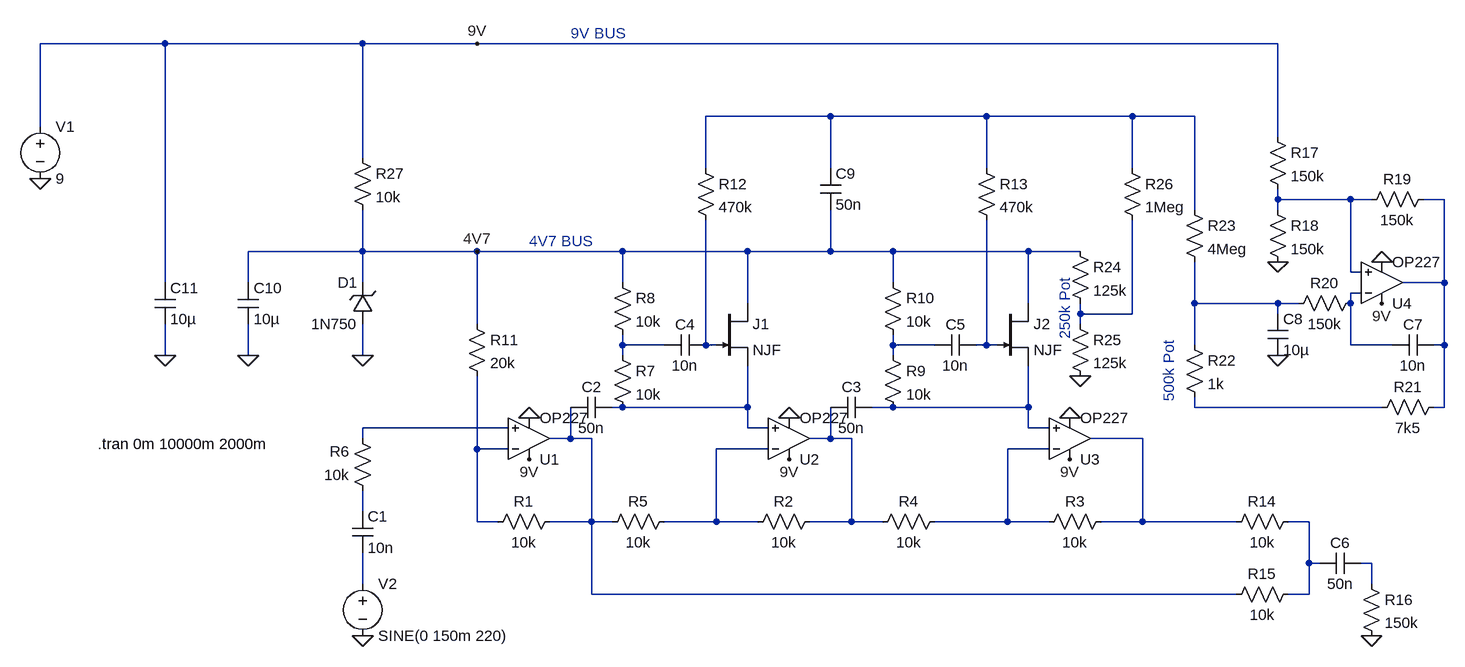
[diagram p0: schematic MainSimu.asc]
MainSimu.asc, the LTspice schematic file:
Version 4
SHEET 1 1520 680
WIRE -496 -368 -688 -368
WIRE -192 -368 -496 -368
WIRE -16 -368 -192 -368
WIRE 1216 -368 -16 -368
WIRE 528 -256 336 -256
WIRE 768 -256 528 -256
WIRE 992 -256 768 -256
WIRE 1088 -256 992 -256
WIRE -688 -240 -688 -368
WIRE 1216 -224 1216 -368
WIRE -192 -192 -192 -368
WIRE 336 -176 336 -256
WIRE 528 -176 528 -256
WIRE 768 -176 768 -256
WIRE 992 -176 992 -256
WIRE 1216 -128 1216 -144
WIRE 1328 -128 1216 -128
WIRE 1360 -128 1328 -128
WIRE 1472 -128 1440 -128
WIRE 1088 -112 1088 -256
WIRE 1216 -112 1216 -128
WIRE -192 -48 -192 -112
WIRE -192 -48 -368 -48
WIRE -16 -48 -192 -48
WIRE 208 -48 -16 -48
WIRE 400 -48 208 -48
WIRE 528 -48 528 -112
WIRE 528 -48 400 -48
WIRE 624 -48 528 -48
WIRE 832 -48 624 -48
WIRE 912 -48 832 -48
WIRE 1328 -16 1328 -128
WIRE 1344 -16 1328 -16
WIRE -496 0 -496 -368
WIRE -368 0 -368 -48
WIRE -192 0 -192 -48
WIRE 208 0 208 -48
WIRE 624 0 624 -48
WIRE 1472 0 1472 -128
WIRE 1472 0 1408 0
WIRE 1344 16 1328 16
WIRE 400 32 400 -48
WIRE 832 32 832 -48
WIRE 1088 32 1088 -32
WIRE 1216 32 1088 32
WIRE 1248 32 1216 32
WIRE 1328 32 1328 16
WIRE 912 48 912 32
WIRE 992 48 992 -96
WIRE 992 48 912 48
WIRE 1216 48 1216 32
WIRE -16 64 -16 -48
WIRE 912 64 912 48
WIRE 208 96 208 80
WIRE 272 96 208 96
WIRE 336 96 336 -96
WIRE 352 96 336 96
WIRE 624 96 624 80
WIRE 688 96 624 96
WIRE 768 96 768 -96
WIRE 768 96 752 96
WIRE 784 96 768 96
WIRE 1088 96 1088 32
WIRE 1328 96 1328 32
WIRE 1392 96 1328 96
WIRE 1472 96 1472 0
WIRE 1472 96 1456 96
WIRE -496 112 -496 64
WIRE -368 112 -368 64
WIRE -192 112 -192 64
WIRE 208 112 208 96
WIRE 624 112 624 96
WIRE 208 192 192 192
WIRE 400 192 400 128
WIRE 400 192 208 192
WIRE 624 192 592 192
WIRE 832 192 832 128
WIRE 832 192 624 192
WIRE 1088 192 1088 176
WIRE 1376 192 1088 192
WIRE 1472 192 1472 96
WIRE 1472 192 1456 192
WIRE 32 224 -192 224
WIRE 400 224 400 192
WIRE 432 224 400 224
WIRE 832 224 832 192
WIRE 864 224 832 224
WIRE -192 240 -192 224
WIRE 128 240 128 192
WIRE 128 240 96 240
WIRE 160 240 128 240
WIRE 528 240 528 192
WIRE 528 240 496 240
WIRE 560 240 528 240
WIRE 1008 240 928 240
WIRE -16 256 -16 144
WIRE 32 256 -16 256
WIRE 432 256 352 256
WIRE 864 256 800 256
WIRE -192 352 -192 320
WIRE -16 368 -16 256
WIRE 16 368 -16 368
WIRE 160 368 160 240
WIRE 160 368 96 368
WIRE 192 368 160 368
WIRE 352 368 352 256
WIRE 352 368 272 368
WIRE 416 368 352 368
WIRE 560 368 560 240
WIRE 560 368 496 368
WIRE 608 368 560 368
WIRE 800 368 800 256
WIRE 800 368 688 368
WIRE 864 368 800 368
WIRE 1008 368 1008 240
WIRE 1008 368 944 368
WIRE 1152 368 1008 368
WIRE 1264 368 1232 368
WIRE 1264 432 1264 368
WIRE 1280 432 1264 432
WIRE 1360 432 1344 432
WIRE -192 464 -192 416
WIRE 1360 464 1360 432
WIRE 160 480 160 368
WIRE 1152 480 160 480
WIRE 1264 480 1264 432
WIRE 1264 480 1232 480
FLAG 1360 544 0
FLAG 1216 112 0
FLAG 1216 -32 0
FLAG 912 144 0
FLAG -688 -160 0
FLAG -192 112 0
FLAG -368 112 0
FLAG -496 112 0
FLAG -192 544 0
FLAG -16 -48 4V7
FLAG -16 -368 9V
FLAG 64 272 9V
FLAG 464 272 9V
FLAG 896 272 9V
FLAG 1376 32 9V
FLAG 64 208 0
FLAG 464 208 0
FLAG 896 208 0
FLAG 1376 -32 0
SYMBOL OpAmps/OP227 64 304 M180
SYMATTR InstName U1
SYMBOL OpAmps/OP227 464 304 M180
SYMATTR InstName U2
SYMBOL OpAmps/OP227 896 304 M180
SYMATTR InstName U3
SYMBOL OpAmps/OP227 1376 64 M180
SYMATTR InstName U4
SYMBOL Res 112 352 R90
WINDOW 0 0 56 VBottom 2
WINDOW 3 32 56 VTop 2
SYMATTR InstName R1
SYMATTR Value 10k
SYMBOL Res 512 352 R90
WINDOW 0 0 56 VBottom 2
WINDOW 3 32 56 VTop 2
SYMATTR InstName R2
SYMATTR Value 10k
SYMBOL Res 960 352 R90
WINDOW 0 0 56 VBottom 2
WINDOW 3 32 56 VTop 2
SYMATTR InstName R3
SYMATTR Value 10k
SYMBOL Res 704 352 R90
WINDOW 0 0 56 VBottom 2
WINDOW 3 32 56 VTop 2
SYMATTR InstName R4
SYMATTR Value 10k
SYMBOL Res 288 352 R90
WINDOW 0 0 56 VBottom 2
WINDOW 3 32 56 VTop 2
SYMATTR InstName R5
SYMATTR Value 10k
SYMBOL Res -176 336 R180
WINDOW 0 36 76 Left 2
WINDOW 3 36 40 Left 2
SYMATTR InstName R6
SYMATTR Value 10k
SYMBOL Cap -208 352 R0
SYMATTR InstName C1
SYMATTR Value 10n
SYMBOL Cap 192 176 R90
WINDOW 0 0 32 VBottom 2
WINDOW 3 32 32 VTop 2
SYMATTR InstName C2
SYMATTR Value 50n
SYMBOL Cap 592 176 R90
WINDOW 0 0 32 VBottom 2
WINDOW 3 32 32 VTop 2
SYMATTR InstName C3
SYMATTR Value 50n
SYMBOL Res 192 96 R0
SYMATTR InstName R7
SYMATTR Value 10k
SYMBOL Res 192 -16 R0
SYMATTR InstName R8
SYMATTR Value 10k
SYMBOL Cap 336 80 R90
WINDOW 0 0 32 VBottom 2
WINDOW 3 32 32 VTop 2
SYMATTR InstName C4
SYMATTR Value 10n
SYMBOL njf 352 32 R0
SYMATTR InstName J1
SYMBOL Res 608 96 R0
SYMATTR InstName R9
SYMATTR Value 10k
SYMBOL Res 608 -16 R0
SYMATTR InstName R10
SYMATTR Value 10k
SYMBOL njf 784 32 R0
SYMATTR InstName J2
SYMBOL Cap 752 80 R90
WINDOW 0 0 32 VBottom 2
WINDOW 3 32 32 VTop 2
SYMATTR InstName C5
SYMATTR Value 10n
SYMBOL Res -32 48 R0
SYMATTR InstName R11
SYMATTR Value 20k
SYMBOL Res 320 -192 R0
SYMATTR InstName R12
SYMATTR Value 470k
SYMBOL Res 752 -192 R0
SYMATTR InstName R13
SYMATTR Value 470k
SYMBOL Res 1248 352 R90
WINDOW 0 0 56 VBottom 2
WINDOW 3 32 56 VTop 2
SYMATTR InstName R14
SYMATTR Value 10k
SYMBOL Res 1248 464 R90
WINDOW 0 0 56 VBottom 2
WINDOW 3 32 56 VTop 2
SYMATTR InstName R15
SYMATTR Value 10k
SYMBOL Cap 1344 416 R90
WINDOW 0 0 32 VBottom 2
WINDOW 3 32 32 VTop 2
SYMATTR InstName C6
SYMATTR Value 50n
SYMBOL Res 1344 448 R0
SYMATTR InstName R16
SYMATTR Value 150k
SYMBOL Res 1200 -240 R0
SYMATTR InstName R17
SYMATTR Value 150k
SYMBOL Res 1200 -128 R0
SYMATTR InstName R18
SYMATTR Value 150k
SYMBOL Res 1456 -144 R90
WINDOW 0 0 56 VBottom 2
WINDOW 3 32 56 VTop 2
SYMATTR InstName R19
SYMATTR Value 150k
SYMBOL Cap 1456 80 R90
WINDOW 0 0 32 VBottom 2
WINDOW 3 32 32 VTop 2
SYMATTR InstName C7
SYMATTR Value 10n
SYMBOL Res 1344 16 R90
WINDOW 0 0 56 VBottom 2
WINDOW 3 32 56 VTop 2
SYMATTR InstName R20
SYMATTR Value 150k
SYMBOL Cap 1200 48 R0
SYMATTR InstName C8
SYMATTR Value 10µ
SYMBOL Res 1472 176 R90
WINDOW 0 0 56 VBottom 2
WINDOW 3 32 56 VTop 2
SYMATTR InstName R21
SYMATTR Value 7k5
SYMBOL Res 1072 80 R0
SYMATTR InstName R22
SYMATTR Value 1k
SYMBOL Res 1072 -128 R0
SYMATTR InstName R23
SYMATTR Value 4Meg
SYMBOL Res 896 -64 R0
SYMATTR InstName R24
SYMATTR Value 125k
SYMBOL Res 896 48 R0
SYMATTR InstName R25
SYMATTR Value 125k
SYMBOL Res 976 -192 R0
SYMATTR InstName R26
SYMATTR Value 1Meg
SYMBOL voltage -688 -256 R0
SYMATTR InstName V1
SYMATTR Value 9
SYMBOL zener -176 64 R180
WINDOW 0 24 64 Left 2
WINDOW 3 24 0 Left 2
SYMATTR InstName D1
SYMATTR Value 1N750
SYMBOL Res -208 -208 R0
SYMATTR InstName R27
SYMATTR Value 10k
SYMBOL Cap 512 -176 R0
SYMATTR InstName C9
SYMATTR Value 50n
SYMBOL Cap -384 0 R0
SYMATTR InstName C10
SYMATTR Value 10µ
SYMBOL Cap -512 0 R0
SYMATTR InstName C11
SYMATTR Value 10µ
SYMBOL voltage -192 448 R0
SYMATTR InstName V2
SYMATTR Value SINE(0 150m 220)
TEXT 64 -64 Left 2 ;4V7 BUS
TEXT 1048 88 VRight 2 ;500k Pot
TEXT 888 -8 VRight 2 ;250k Pot
TEXT -600 248 Left 2 !.tran 0m 10000m 2000m
TEXT 128 -384 Left 2 ;9V BUS

The netlist it stands for:
* MainSimu.asc
XU1 N014 N018 9V 0 N015 OP227  ; pins In+ In- V+ V- OUT
XU2 N011 N019 9V 0 N016 OP227  ; pins In+ In- V+ V- OUT
XU3 N012 N020 9V 0 N017 OP227  ; pins In+ In- V+ V- OUT
XU4 N002 N004 9V 0 N003 OP227  ; pins In+ In- V+ V- OUT
R1 N015 N018 10k
R2 N016 N019 10k
R3 N017 N020 10k
R4 N020 N016 10k
R5 N019 N015 10k
R6 N021 N014 10k
C1 N021 N024 10n
C2 N011 N015 50n
C3 N012 N016 50n
R7 N007 N011 10k
R8 4V7 N007 10k
C4 N008 N007 10n
J1 4V7 N008 N011 NJF
R9 N009 N012 10k
R10 4V7 N009 10k
J2 4V7 N010 N012 NJF
C5 N010 N009 10n
R11 4V7 N018 20k
R12 N001 N008 470k
R13 N001 N010 470k
R14 N022 N017 10k
R15 N022 N015 10k
C6 N023 N022 50n
R16 N023 0 150k
R17 9V N002 150k
R18 N002 0 150k
R19 N003 N002 150k
C7 N003 N004 10n
R20 N004 N005 150k
C8 N005 0 10µ
R21 N003 N013 7k5
R22 N005 N013 1k
R23 N001 N005 4Meg
R24 4V7 N006 125k
R25 N006 0 125k
R26 N001 N006 1Meg
V1 9V 0 9
D1 0 4V7 1N750
R27 9V 4V7 10k
C9 N001 4V7 50n
C10 4V7 0 10µ
C11 9V 0 10µ
V2 N024 0 SINE(0 150m 220)
.model D D
.lib standard.dio
.model NJF NJF
.model PJF PJF
.lib standard.jft
* 4V7 BUS
* 500k Pot
* 250k Pot
.tran 0m 10000m 2000m
* 9V BUS
.backanno
.end